# Altium schematic sheet TITLE PAGE.SchDoc: TITLE PAGE
size A; SheetNumber: 1; SheetTotal: 9
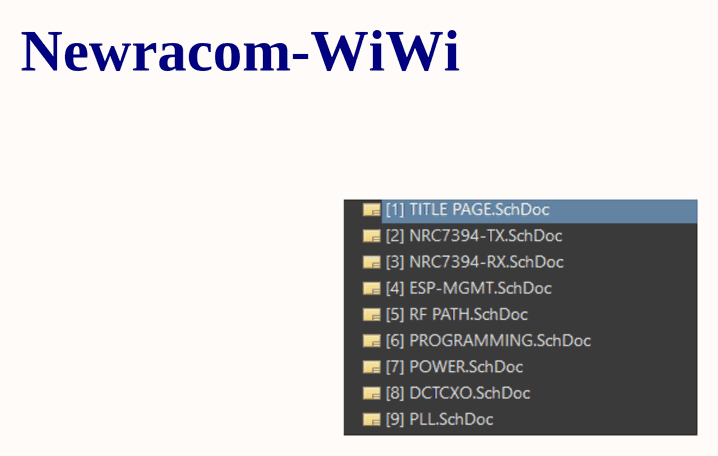
[diagram p0: TITLE PAGE.SchDoc]

## Notes on the sheet
- Newracom-WiWi